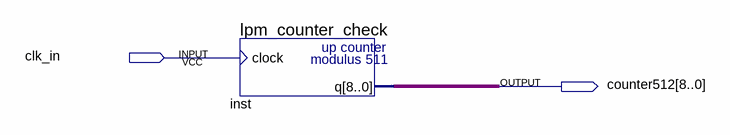
[diagram p0: schematic sheet]
// Quartus schematic Block1.bdf as structural Verilog: 1 symbols, 2 pins
module Block1 (
  input  clk_in,
  output [8:0] counter512
);

  lpm_counter_check inst (.clock(clk_in), .q(counter512));
endmodule
